# EAGLE design inker_super_board_ver0 (EAGLE 9.5.2)
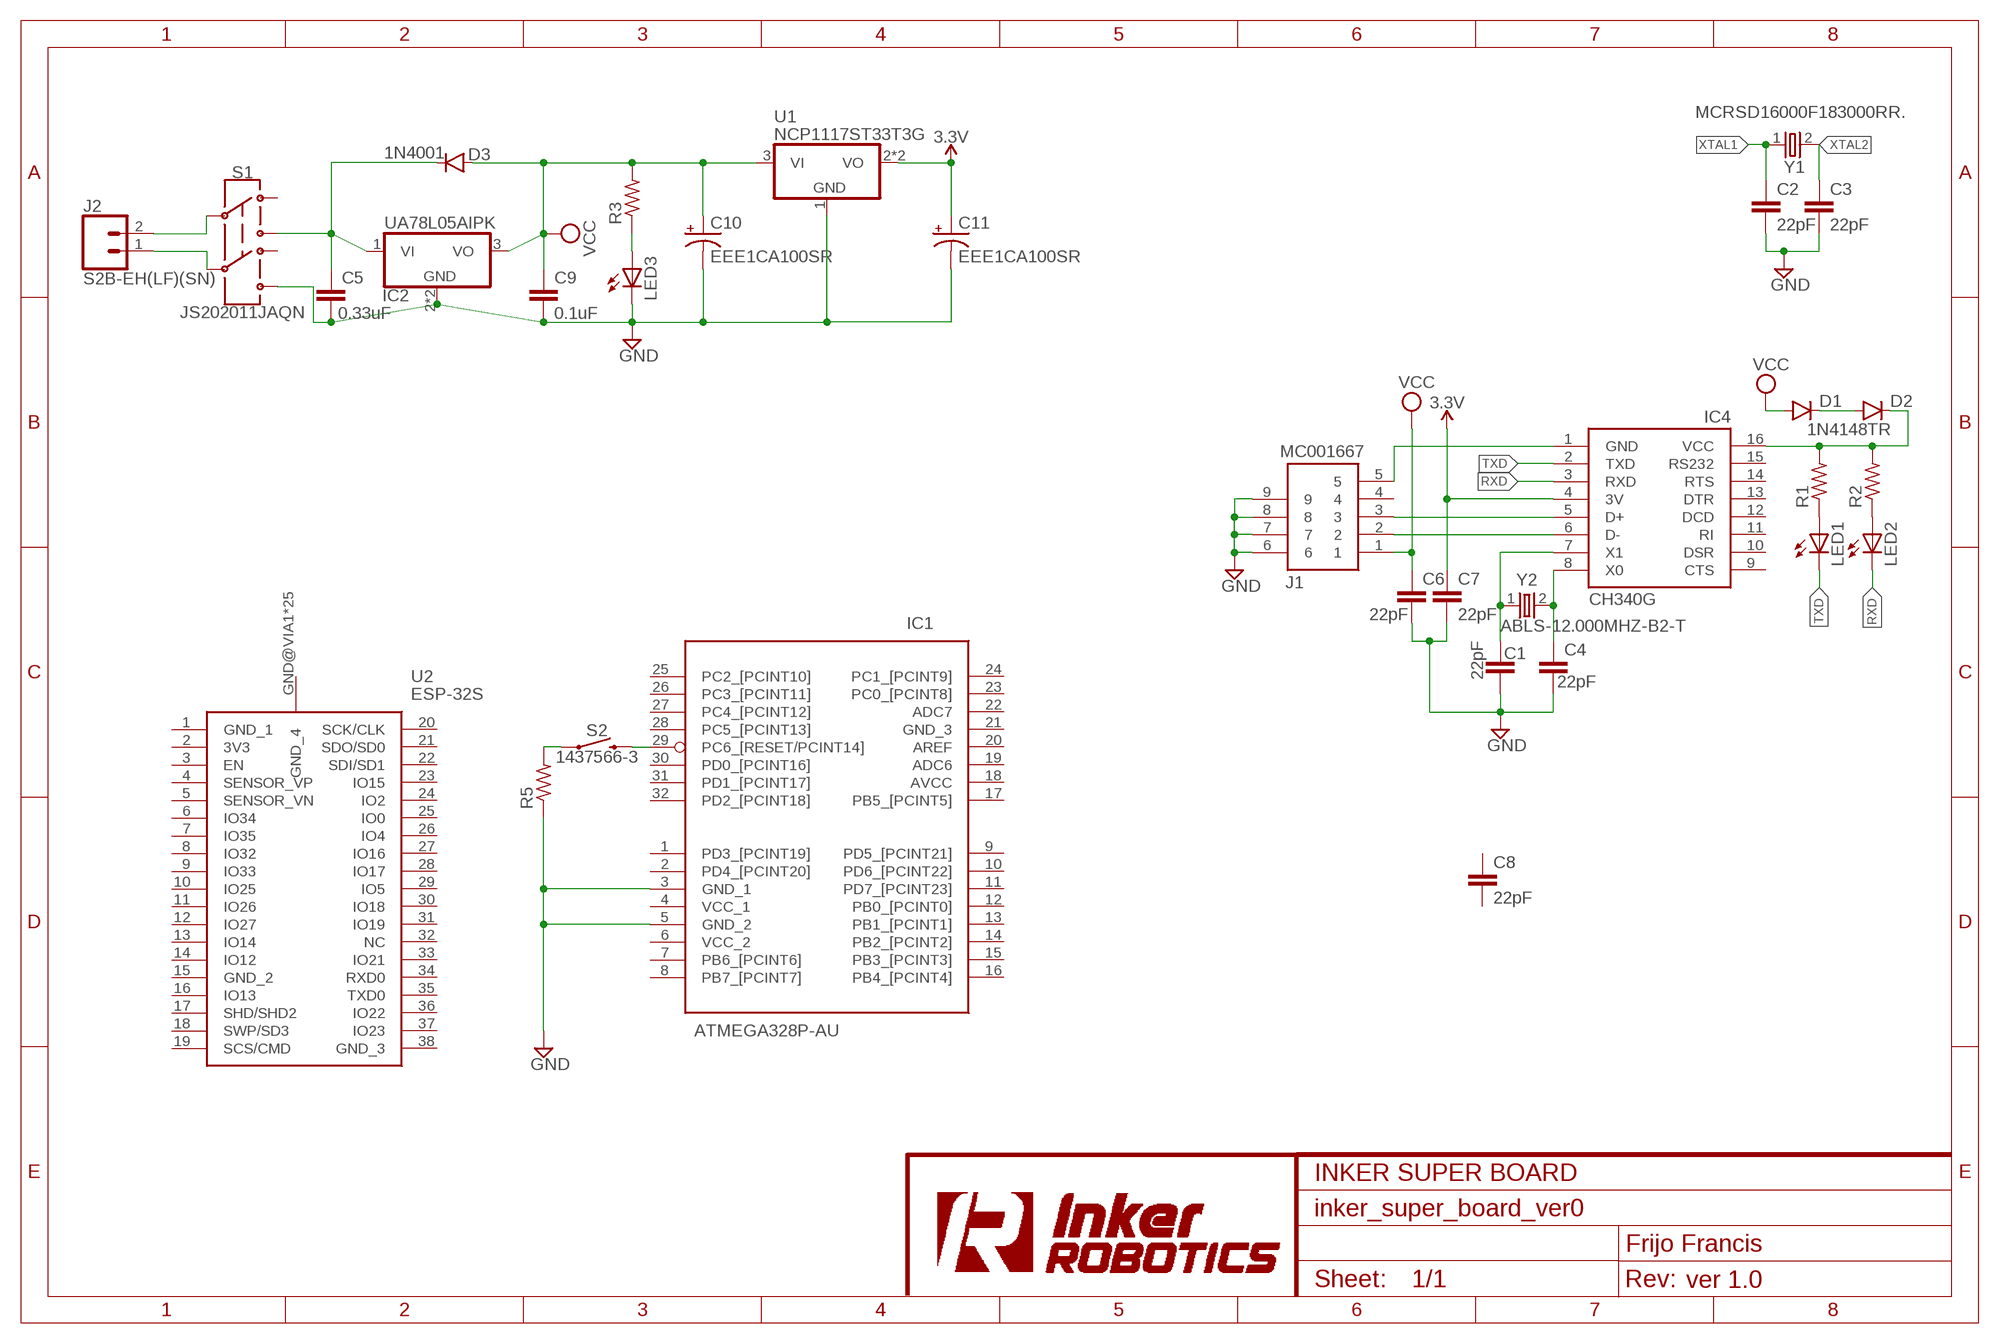
[diagram p0: schematic, sheet 1]
FRAME1 (FRAME-A4L): CNAME: INKER SUPER BOARD; CREVISION: ver 1.0; DESIGNER: Frijo Francis

## Parts
C1  22pF  22PF-0603-50V-5%  [0603]
C2  22pF  22PF-0603-50V-5%  [0603]
C3  22pF  22PF-0603-50V-5%  [0603]
C4  22pF  22PF-0603-50V-5%  [0603]
C5  0.33uF  1.0UF-0805-25V-10%  [0805]
C6  22pF  22PF-0603-50V-5%  [0603]
C7  22pF  22PF-0603-50V-5%  [0603]
C8  22pF  22PF-0603-50V-5%  [0603]
C9  0.1uF  1.0UF-0805-25V-10%  [0805]
C10  EEE1CA100SR  [EEE1CA100SR]
C11  EEE1CA100SR  [EEE1CA100SR]
D1  1N4148TR  [DIOAD990W55L340D162]
D2  1N4148TR  [DIOAD990W55L340D162]
D3  1N4001  [DIOAD1405W86L465D235]
IC1  ATMEGA328P-AU  [QFP80P900X900X120-32N]
IC2  UA78L05AIPK  [PK(R-PSSO-F3)]
IC4  CH340G  [SO16]
J1  MC001667  [MC001667]
J2  S2B-EH(LF)(SN)  [SHDR2W64P0X250_1X2_750X820X420]
LED1  LEDCHIP-LED0805  [CHIP-LED0805]
LED2  LEDCHIP-LED0805  [CHIP-LED0805]
LED3  LEDCHIP-LED0805  [CHIP-LED0805]
R1  R-US_R0805  [R0805]
R2  R-US_R0805  [R0805]
R3  R-US_R0805  [R0805]
R5  R-US_R0805  [R0805]
S1  JS202011JAQN  [JS202011JAQN]
S2  1437566-3  [14375663]
U1  NCP1117ST33T3G  [SOT230P700X180-4N]
U2  ESP-32S  [ESP-32S]
Y1  MCRSD16000F183000RR.  [MCRSD16000F183000RR]
Y2  ABLS-12.000MHZ-B2-T  [ABLS-12.000MHZ-B2]

## Nets
3.3V: C7.1 C11.1(+) IC4.4(3V) U1.2(VO) U1.4(VO)
GND: C1.2 C2.2 C3.2 C4.2 C5.2 C6.2 C7.2 C9.2 C10.2(-) C11.2(-) IC1.3(GND_1) IC1.5(GND_2) IC2.2(GND) IC2.4(GND) J1.6 J1.7 J1.8 J1.9 LED3.C R5.1 S1.6 U1.1(GND)
N$1: LED1.A R1.1
N$2: LED2.A R2.1
N$3: LED3.A R3.1
N$4: IC1.29(PC6_[RESET/PCINT14]) S2.2
N$5: R5.2 S2.1
N$6: C1.1 IC4.7(X1) Y2.1
N$7: C4.1 IC4.8(X0) Y2.2
N$8: D2.1(C) IC4.16(VCC) R1.2 R2.2
N$9: D1.1(C) D2.2(A)
N$10: IC4.6(D-) J1.2
N$11: IC4.5(D+) J1.3
N$12: J2.2 S1.2
N$13: J2.1 S1.5
N$16: IC4.1(GND) J1.5
RXD: IC4.3(RXD) LED2.C
TXD: IC4.2(TXD) LED1.C
VCC: C6.1 C9.1 C10.1(+) D1.2(A) D3.2(A) IC2.3(VO) J1.1 R3.2 U1.3(VI)
VIN: C5.1 D3.1(C) IC2.1(VI) S1.3
XTAL1: C2.1 Y1.1
XTAL2: C3.1 Y1.2
Unconnected: C8.1 C8.2 IC1.1(PD3_[PCINT19]) IC1.2(PD4_[PCINT20]) IC1.7(PB6_[PCINT6]) IC1.8(PB7_[PCINT7]) IC1.9(PD5_[PCINT21]) IC1.10(PD6_[PCINT22]) IC1.11(PD7_[PCINT23]) IC1.12(PB0_[PCINT0]) IC1.13(PB1_[PCINT1]) IC1.14(PB2_[PCINT2]) IC1.15(PB3_[PCINT3]) IC1.16(PB4_[PCINT4]) IC1.17(PB5_[PCINT5]) IC1.19(ADC6) IC1.20(AREF) IC1.22(ADC7) IC1.23(PC0_[PCINT8]) IC1.24(PC1_[PCINT9]) IC1.25(PC2_[PCINT10]) IC1.26(PC3_[PCINT11]) IC1.27(PC4_[PCINT12]) IC1.28(PC5_[PCINT13]) IC1.30(PD0_[PCINT16]) IC1.31(PD1_[PCINT17]) IC1.32(PD2_[PCINT18]) IC4.9(CTS) IC4.10(DSR) IC4.11(RI) IC4.12(DCD) IC4.13(DTR) IC4.14(RTS) IC4.15(RS232) J1.4 S1.1 S1.4 U2.1(GND_1) U2.2(3V3) U2.3(EN) U2.4(SENSOR_VP) U2.5(SENSOR_VN) U2.6(IO34) U2.7(IO35) U2.8(IO32) U2.9(IO33) U2.10(IO25) U2.11(IO26) U2.12(IO27) U2.13(IO14) U2.14(IO12) U2.15(GND_2) U2.16(IO13) U2.17(SHD/SHD2) U2.18(SWP/SD3) U2.19(SCS/CMD) U2.20(SCK/CLK) U2.21(SDO/SD0) U2.22(SDI/SD1) U2.23(IO15) U2.24(IO2) U2.25(IO0) U2.26(IO4) U2.27(IO16) U2.28(IO17) U2.29(IO5) U2.30(IO18) U2.31(IO19) U2.32(NC) U2.33(IO21) U2.34(RXD0) U2.35(TXD0) U2.36(IO22) U2.37(IO23) U2.38(GND_3) U2.GND@VIA1(GND_4) U2.GND@VIA2(GND_4) U2.GND@VIA3(GND_4) U2.GND@VIA4(GND_4) U2.GND@VIA5(GND_4) U2.GND@VIA6(GND_4) U2.GND@VIA7(GND_4) U2.GND@VIA8(GND_4) U2.GND@VIA9(GND_4) U2.GND@VIA10(GND_4) U2.GND@VIA11(GND_4) U2.GND@VIA12(GND_4) U2.GND@VIA13(GND_4) U2.GND@VIA14(GND_4) U2.GND@VIA15(GND_4) U2.GND@VIA16(GND_4) U2.GND@VIA17(GND_4) U2.GND@VIA18(GND_4) U2.GND@VIA19(GND_4) U2.GND@VIA20(GND_4) U2.GND@VIA21(GND_4) U2.GND@VIA22(GND_4) U2.GND@VIA23(GND_4) U2.GND@VIA24(GND_4) U2.GND@VIA25(GND_4)

## Power pins joined to a net without a drawn wire
AVCC: IC1.18(AVCC)
GND_3: IC1.21(GND_3)
VCC_1: IC1.4(VCC_1)
VCC_2: IC1.6(VCC_2)

## Library data of the parts
C1-C4 C6-C8 = SparkFun-Capacitors:22PF: 22pF ceramic capacitors A capacitor is a passive two-terminal electrical component used to store electrical energy temporarily in an electric field.; PROD_ID: CAP-07876
C5 C9 = SparkFun-Capacitors:1.0UF: 1µF ceramic capacitors A capacitor is a passive two-terminal electrical component used to store electrical energy temporarily in an electric field.; PROD_ID: CAP-08064; VALUE: 1.0uF
C10 C11 = inker_blue_board_parts:EEE1CA100SR: Specifications SMD Aluminium Electrolytic Capacitor, Radial Can - SMD, 10 µF, 16 V, S Series, 2000 hours @ 85°C 4mmx5.4mm Data Sheet <http://www.farnell.com/datasheets/2820389.pdf?_ga=2.97766294.826706780.1579496581-49794231.1579175850&_gac=1.88196841.1579699319.CjwKCAiAgqDxBRBTEiwA59eEN7pioChiorycKBgKjnCHc4IfiDMsctUZX92ybQI3HFoqLGgSVzjkWRoClNIQAvD_BwE> Buy From Element14.com <https://in.element14.com/panasonic/eee1ca100sr/cap-10-f-16v-smd-reel/dp/2753038>
D1 D2 = inker_blue_board_parts:1N4148TR: DIODE, SMALL SIGNAL, 100V, 450MA, DO-35 PKG Source: Datasheet <https://www.vishay.com/docs/81857/1n4148.pdf>; DESCRIPTION: DIODE, SMALL SIGNAL, 100V, 450MA, DO-35 PKG; HEIGHT: mm; MANUFACTURER_NAME: Vishay; MANUFACTURER_PART_NUMBER: 1N4148TR; MOUSER_PART_NUMBER: 78-1N4148; MOUSER_PRICE-STOCK: https://www.mouser.com/Search/Refine.aspx?Keyword=78-1N4148; RS_PART_NUMBER: 1808536; RS_PRICE-STOCK: http://uk.rs-online.com/web/p/products/1808536
D3 = inker_blue_board_parts:1N4001: Vishay 1N4001 Diode, 50V 1A, 2-Pin DO-204AL Source: Datasheet <https://www.vishay.com/docs/88503/1n4001.pdf>; DESCRIPTION: Vishay 1N4001 Diode, 50V 1A, 2-Pin DO-204AL; HEIGHT: mm; MANUFACTURER_NAME: Vishay; MANUFACTURER_PART_NUMBER: 1N4001; RS_PART_NUMBER: 0261148A; RS_PRICE-STOCK: http://uk.rs-online.com/web/p/products/0261148A
IC1 = inker_blue_board_parts:ATMEGA328P-AU: MICROCHIP - ATMEGA328P-AU. - MICROCONTROLLER MCU, 8 BIT, ATMEGA, 20MHZ, TQFP-32 Source: Datasheet <https://componentsearchengine.com/Datasheets/2/ATMEGA328P-AU.pdf>; DESCRIPTION: MICROCHIP - ATMEGA328P-AU. - MICROCONTROLLER MCU, 8 BIT, ATMEGA, 20MHZ, TQFP-32; HEIGHT: 1.2mm; MANUFACTURER_NAME: Microchip; MANUFACTURER_PART_NUMBER: ATMEGA328P-AU; MOUSER_PART_NUMBER: 556-ATMEGA328P-AU; MOUSER_PRICE-STOCK: https://www.mouser.com/Search/Refine.aspx?Keyword=556-ATMEGA328P-AU; RS_PART_NUMBER: 1310271P; RS_PRICE-STOCK: http://uk.rs-online.com/web/p/products/1310271P
IC2 = inker_blue_board_parts:UA78L05AIPK: 100-mA, 30-V VIN, Positive-Voltage Linear Regulators Source: Datasheet <http://www.ti.com/lit/ds/symlink/ua78l.pdf>; DESCRIPTION: 100-mA, 30-V VIN, Positive-Voltage Linear Regulators; HEIGHT: mm; MANUFACTURER_NAME: Texas Instruments; MANUFACTURER_PART_NUMBER: UA78L05AIPK; MOUSER_PART_NUMBER: 595-UA78L05AIPK; MOUSER_PRICE-STOCK: https://www.mouser.com/Search/Refine.aspx?Keyword=595-UA78L05AIPK; RS_PART_NUMBER: 6614598P; RS_PRICE-STOCK: http://uk.rs-online.com/web/p/products/6614598P
IC4 = inker_blue_board_parts:CH340G: CH340G SOIC16 USB to Serial TTL-RS232 converter IC Full speed USB device interface, conforms to USB Specification Version 2.0, only needs crystal and capacitance external. Emulate standard serial interface, used to upgrade the former peripheral device, or add excess serial interface through USB. Totally compatible with the serial application program in a computer endpoint Windows operation system. Hardware full duplex serial interface, set transceiver buffer, supports communication baud rate varies from 50bps to 2Mbps. Supports common MODEM liaison signal RTS, DTR, DCD, RI, DSR and CTS. Through adding level converter equipment to supply RS232, RS485, RS422 and another interface. Supports IrDA criterion SIR infrared communication, supports baud rate varies from 2400bps to 115200bps.
J1 = inker_blue_board_parts:MC001667: MULTICOMP - MC001667 - MICRO USB, TYPE B, RCPT, SMT Source: Datasheet <https://componentsearchengine.com/Datasheets/2/MC001667.pdf>; DESCRIPTION: MULTICOMP - MC001667 - MICRO USB, TYPE B, RCPT, SMT; HEIGHT: 2mm; MANUFACTURER_NAME: MULTICOMP; MANUFACTURER_PART_NUMBER: MC001667
J2 = inker_blue_board_parts:S2B-EH(LF)(SN): JST (JAPAN SOLDERLESS TERMINALS) - S2B-EH(LF)(SN) - CONNECTOR, HEADER, 2POS, 1ROW, 2.5MM Source: Datasheet <http://www.jst-mfg.com/product/pdf/eng/eEH.pdf>; DESCRIPTION: JST (JAPAN SOLDERLESS TERMINALS) - S2B-EH(LF)(SN) - CONNECTOR, HEADER, 2POS, 1ROW, 2.5MM; HEIGHT: 4.2mm; MANUFACTURER_NAME: JST (JAPAN SOLDERLESS TERMINALS); MANUFACTURER_PART_NUMBER: S2B-EH(LF)(SN)
LED1-LED3 = adafruit:LED: LED OSRAM: - CHIPLED LG R971, LG N971, LY N971, LG Q971, LY Q971, LO R971, LY R971 LH N974, LH R974 LS Q976, LO Q976, LY Q976 LO Q996 - Hyper CHIPLED LW Q18S LB Q993, LB Q99A, LB R99A - SideLED LS A670, LO A670, LY A670, LG A670, LP A670 LB A673, LV A673, LT A673, LW A673 LH A674 LY A675 LS A676, LA A676, LO A676, LY A676, LW A676 LS A679, LY A679, LG A679 - Hyper Micro SIDELED® LS Y876, LA Y876, LO Y876, LY Y876 LT Y87S - SmartLED LW L88C, LW L88S LB L89C, LB L89S, LG L890 LS L89K, LO L89K, LY L89K LS L896, LA L896, LO L896, LY L896 - TOPLED LS T670, LO T670, LY T670, LG T670, LP T670 LSG T670, LSP T670, LSY T670, LOP T670, LYG T670 LG T671, LOG T671, LSG T671 LB T673, LV T673, LT T673, LW T673 LH T674 LS T676, LA T676, LO T676, LY T676, LB T676, LH T676, LSB T676, LW T676 LB T67C, LV T67C, LT T67C, LS T67K, LO T67K, LY T67K, LW E67C LS E67B, LA E67B, LO E67B, LY E67B, LB E67C, LV E67C, LT E67C LW T67C LS T679, LY T679, LG T679 LS T770, LO T770, LY T770, LG T770, LP T770 LB T773, LV T773, LT T773, LW T773 LH T774 LS E675, LA E675, LY E675, LS T675 LS T776, LA T776, LO T776, LY T776, LB T776 LHGB T686 LT T68C, LB T68C - Hyper Mini TOPLED® LB M676 - Mini TOPLED Santana® LG M470 LS M47K, LO M47K, LY M47K Source: http://www.osram.convergy.de/
R1-R3 R5 = adafruit:R-US_: RESISTOR, American symbol
S1 = inker_blue_board_parts:JS202011JAQN: JS Series Sub-Miniature Slide Switch Source: Datasheet <https://www.ckswitches.com/media/1422/js.pdf>; DESCRIPTION: JS Series Sub-Miniature Slide Switch; HEIGHT: 3mm; MANUFACTURER_NAME: C & K COMPONENTS; MANUFACTURER_PART_NUMBER: JS202011JAQN; MOUSER_PART_NUMBER: 611-JS202011JAQN; MOUSER_PRICE-STOCK: https://www.mouser.com/Search/Refine.aspx?Keyword=611-JS202011JAQN
S2 = inker_blue_board_parts:1437566-3: TE CONNECTIVITY / ALCOSWITCH - 1437566-3 - PUSHBUTTON SWITCH, SPST, 0.05A, 24V Source: Datasheet <https://www.te.com/commerce/DocumentDelivery/DDEController?Action=showdoc&DocId=Customer Drawing1437566-3C2pdfEnglishENG_CD_1437566-3_C2_1437566_3_1_c.dwg.pdf1437566-3>; ALLIED_NUMBER: 71210411; ALLIED_PRICE-STOCK: https://www.alliedelec.com/te-connectivity-1437566-3/71210411/; DESCRIPTION: TE CONNECTIVITY / ALCOSWITCH - 1437566-3 - PUSHBUTTON SWITCH, SPST, 0.05A, 24V; HEIGHT: 4.57mm; MANUFACTURER_NAME: TE Connectivity; MANUFACTURER_PART_NUMBER: 1437566-3; MOUSER_PART_NUMBER: N/A; MOUSER_PRICE-STOCK: https://www.mouser.com/Search/Refine.aspx?Keyword=N%2FA
U1 = inker_blue_board_parts:NCP1117ST33T3G; ALLIED_NUMBER: 70340559; ALLIED_PRICE-STOCK: http://www.alliedelec.com/on-semiconductor-ncp1117st33t3g/70340559/; COPYRIGHT: Copyright (C) 2016 Accelerated Designs. All rights reserved; DESCRIPTION: ON SEMICONDUCTOR - NCP1117ST33T3G - IC, LINEAR VOLTAGE REGULATOR; HEIGHT: 1.8mm; MANUFACTURER_NAME: ON Semiconductor; MANUFACTURER_PART_NUMBER: NCP1117ST33T3G; MOUSER_PART_NUMBER: 863-NCP1117ST33T3G; MOUSER_PRICE-STOCK: https://www.mouser.com/Search/Refine.aspx?Keyword=863-NCP1117ST33T3G; RS_PART_NUMBER: 7857207P; RS_PRICE-STOCK: http://uk.rs-online.com/web/p/products/7857207P
U2 = inker_super_board_parts:ESP-32S: WiFi-BT-BLE MCU module Description The ESP32-S is an Original ESP32 series module from Ai-Thinker. This wireless module based on ESP32, supports WiFi and Bluetooth 4.2, with built-in 32Mbit Flash, in the SMD38 package. There're also onboard PCB antenna and metal shield. In short, it's a small form factor and fairly high cost-effective wireless module. With the pre-flashed AT firmware, you can control the module through UART AT commands easily. The module integrates MCU inside, supports other developments like Lua/Micropython/Arduino to achieve flexible and fast prototyping, make it easy to integrate the module into IoT applications. Ai-Thinker's ESP32-S WiFi+BT SoC Module has a highly competitive package size and ultra-low power technology. Esp32-S can be widely used in various networking, for home automation, industrial wireless control, baby monitors, wearable electronics products, wireless position sensing devices, wireless positioning system signals, and other networking applications. Esp32-S is packaged in SMD, through the standard SMT equipment to achieve rapid production of products, to provide customers with high reliability of the connection, especially for Automation, large-scale, low-cost modern production methods, It’s suitable for all kinds of Internet of things hardware terminal occasions. Applications: The ESP32-S suit for many IoT applications such as: Smart home Intelligent building Industrial automation Wearable devices IP camera Intelligent agriculture Source: Datasheet <https://www.es.co.th/Schemetic/PDF/ESP32.PDF>; DESCRIPTION: WiFi-BT-BLE MCU module; HEIGHT: mm; MANUFACTURER_NAME: Ai-Thinker; MANUFACTURER_PART_NUMBER: ESP-32s
Y1 = inker_blue_board_parts:MCRSD16000F183000RR.: Crystal Resonator Source: Datasheet <http://www.farnell.com/datasheets/1801275.pdf?_ga=2.161758137.465763355.1570477591-1898509310.1560488301>; DESCRIPTION: Crystal Resonator; HEIGHT: 4.3mm; MANUFACTURER_NAME: MULTICOMP; MANUFACTURER_PART_NUMBER: MCRSD16000F183000RR.
Y2 = inker_blue_board_parts:ABLS-12.000MHZ-B2-T: HC/49US Crystal 12Mhz Source: Datasheet <https://abracon.com/Resonators/abls.pdf>; DESCRIPTION: HC/49US Crystal 12Mhz; HEIGHT: mm; MANUFACTURER_NAME: ABRACON; MANUFACTURER_PART_NUMBER: ABLS-12.000MHZ-B2-T; MOUSER_PART_NUMBER: 815-ABLS-12-B2; MOUSER_PRICE-STOCK: https://www.mouser.com/Search/Refine.aspx?Keyword=815-ABLS-12-B2; RS_PART_NUMBER: 1710488P; RS_PRICE-STOCK: http://uk.rs-online.com/web/p/products/1710488P

## Board
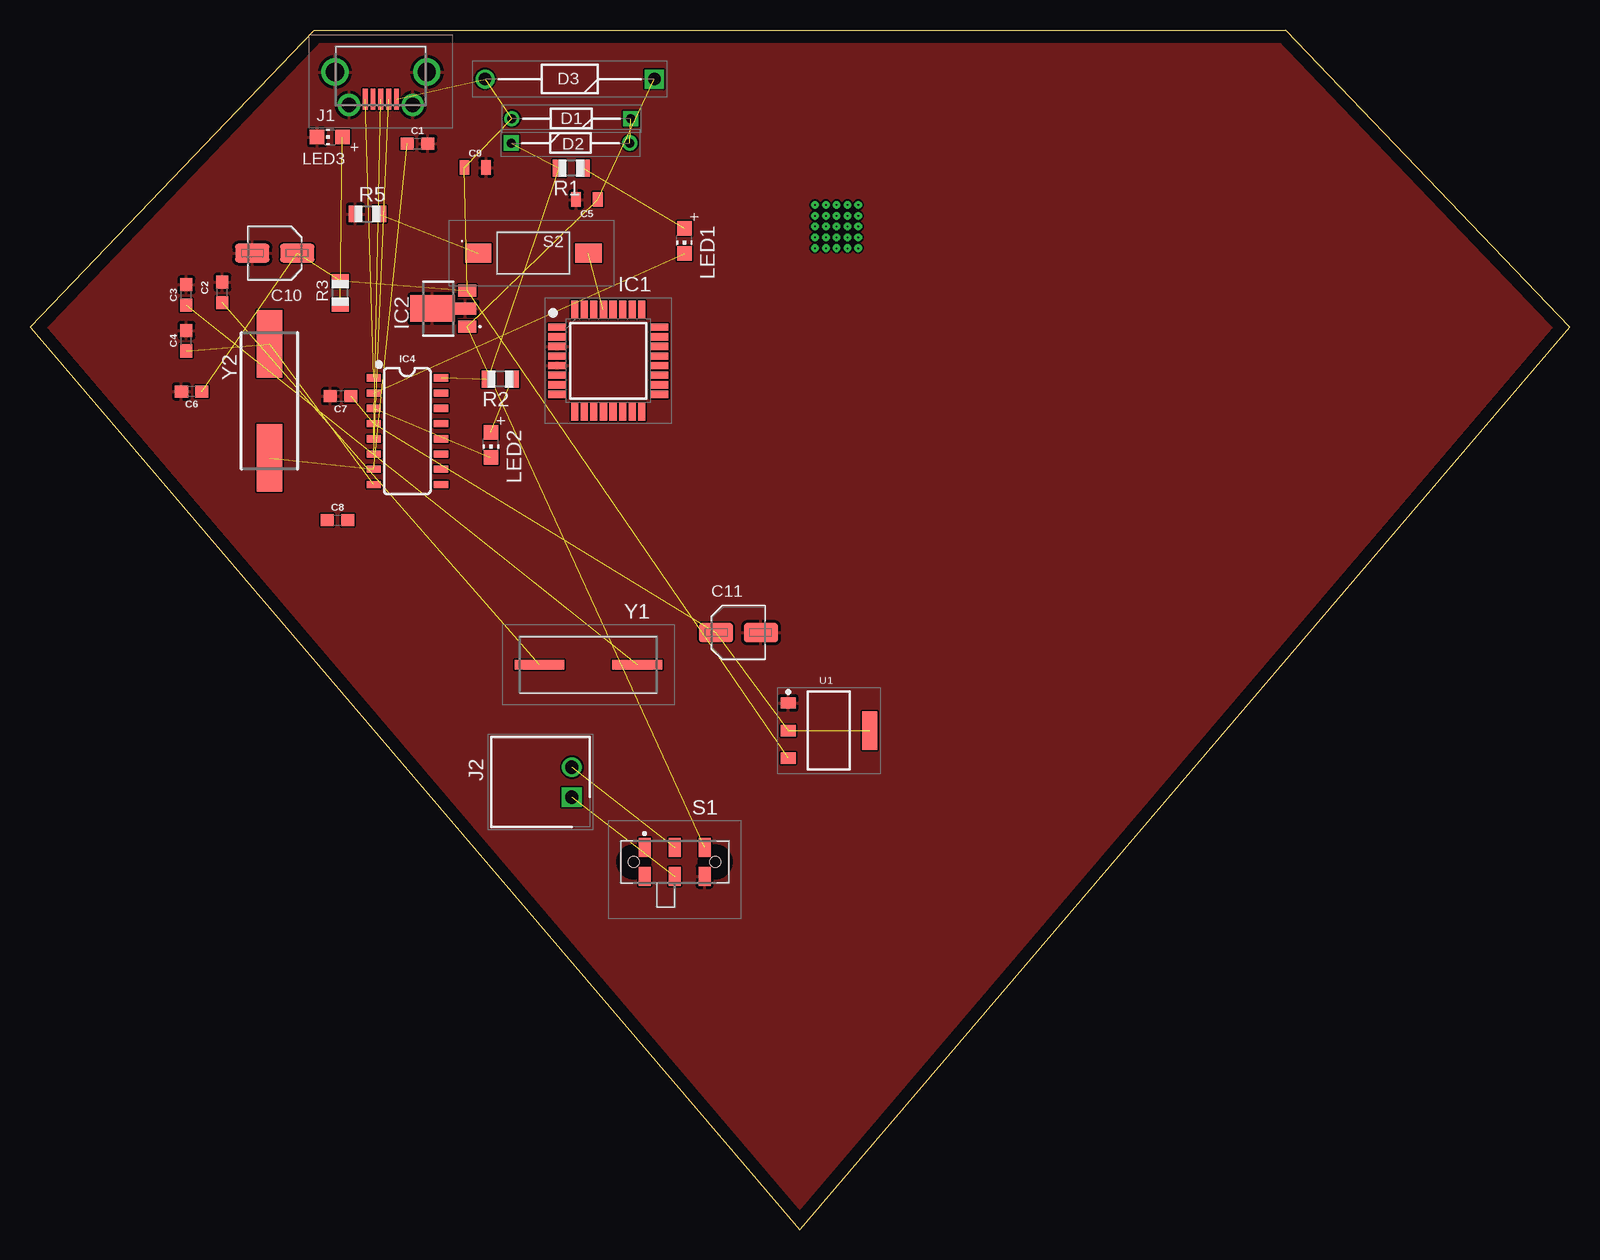
[diagram p1: board, top side]
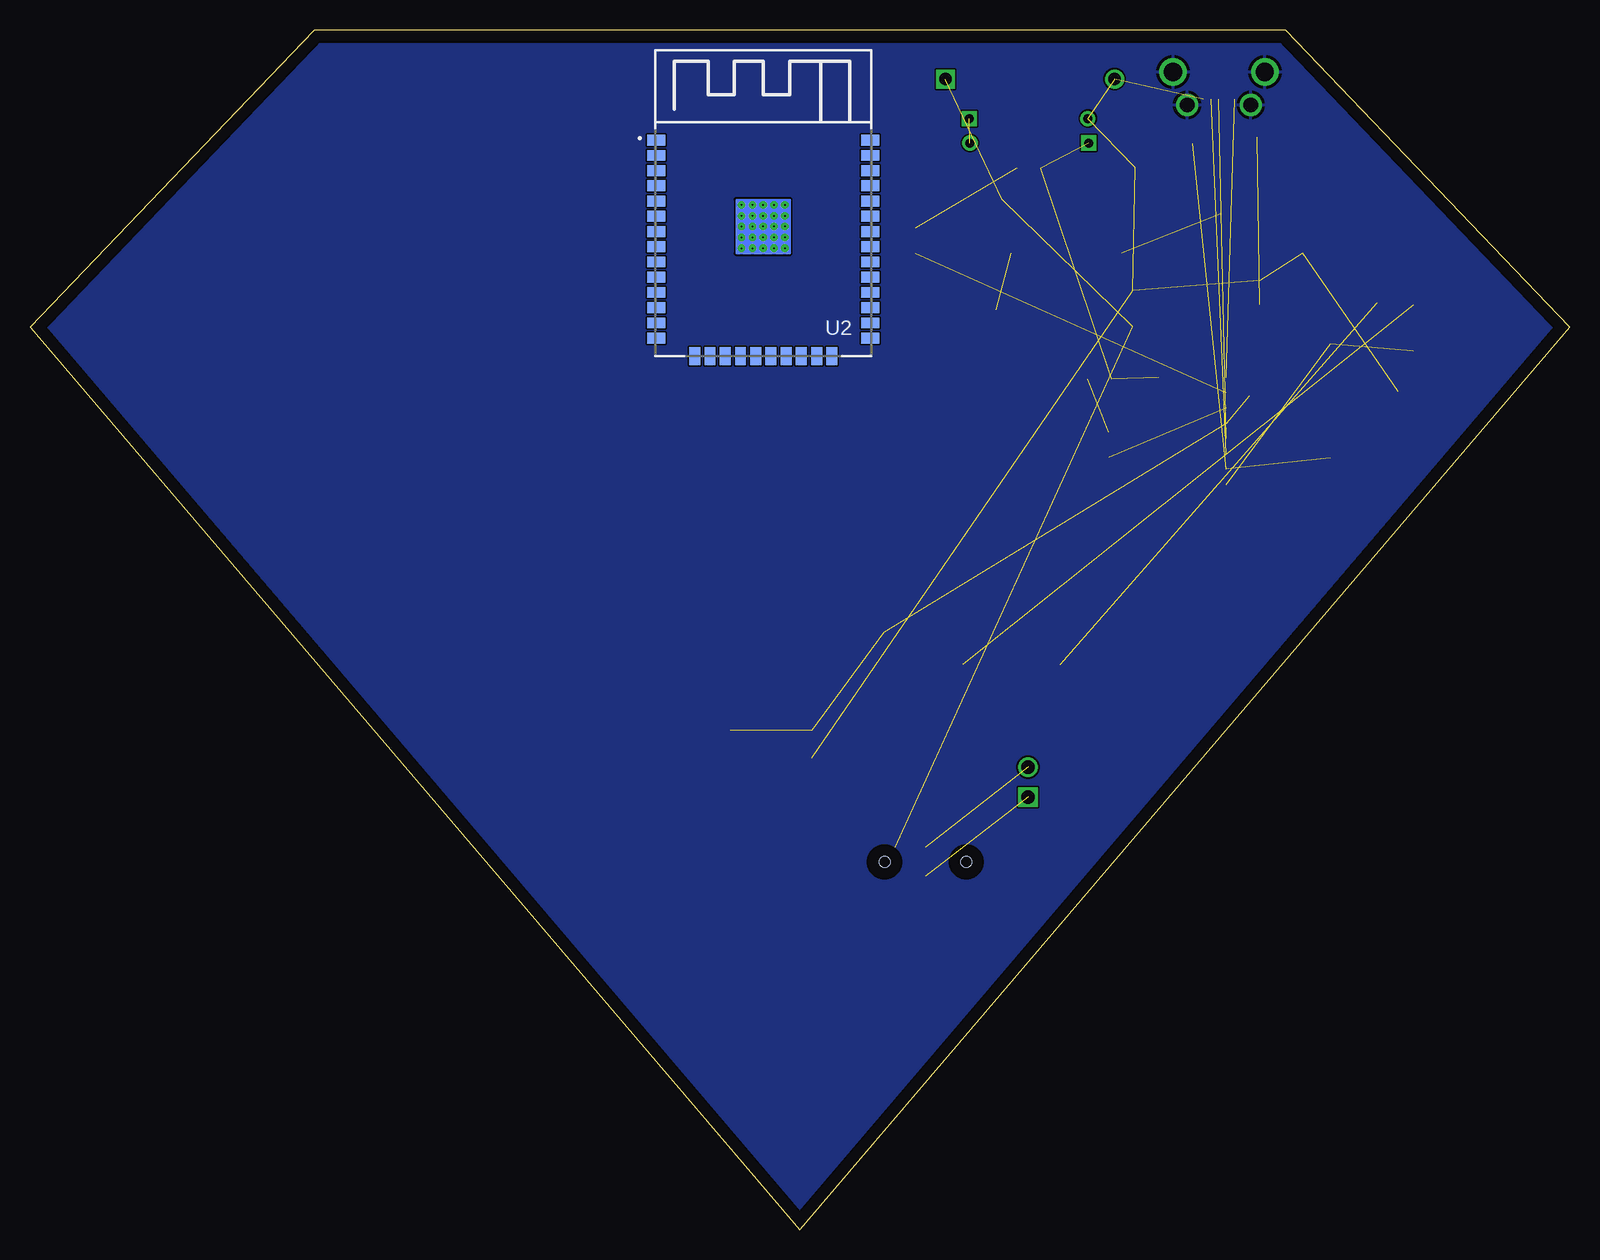
[diagram p2: board, bottom side, seen from below]

Size 128.32 x 100 mm. Coordinates in mm from the lower left corner, seen from the top.
Outline: 128.32,75.21 104.64,100 23.68,100 0,75.21 64.16,0 128.32,75.21
Copper layers (1*16): Top 0.035mm / dielectric 1.5mm / Bottom 0.035mm
Design rules "default *": minimum track width 0.3mm, minimum drill 0.35mm, track to track 6mil, track to pad 6mil, pad to pad 6mil, via to via 6mil, smd to smd 6mil, copper to edge 40mil, drill to drill 6mil, minimum pad ring 10mil, minimum via ring 8mil, stop-mask expansion 4mil, vias tented up to drill 0mil, thermal gap 10mil

### Footprints (pad centres in the part's own frame; a part is rotated, then mirrored left to right if it is on the bottom)
0603 = smd 1.1 x 1: 1 -0.85,0; 2 0.85,0
0805 = smd 0.8 x 1.2: 1 -0.9,0; 2 0.9,0
EEE1CA100SR = smd 2.86 x 1.58: 1 -1.875,0; 2 1.875,0
DIOAD990W55L340D162 = drill 0.75 pad 1.15 square: 1 0,0 | drill 0.75 pad 1.15: 2 9.9,0
DIOAD1405W86L465D235 = drill 1.05 pad 1.575 square: 1 0,0 | drill 1.05 pad 1.575: 2 14.1,0
QFP80P900X900X120-32N = smd 1.5 x 0.6: 1 -4.25,2.8; 2 -4.25,2; 3 -4.25,1.2; 4 -4.25,0.4; 5 -4.25,-0.4; 6 -4.25,-1.2; 7 -4.25,-2; 8 -4.25,-2.8; 17 4.25,-2.8; 18 4.25,-2; 19 4.25,-1.2; 20 4.25,-0.4; 21 4.25,0.4; 22 4.25,1.2; 23 4.25,2; 24 4.25,2.8 | smd 0.6 x 1.5: 9 -2.8,-4.25; 10 -2,-4.25; 11 -1.2,-4.25; 12 -0.4,-4.25; 13 0.4,-4.25; 14 1.2,-4.25; 15 2,-4.25; 16 2.8,-4.25; 25 2.8,4.25; 26 2,4.25; 27 1.2,4.25; 28 0.4,4.25; 29 -0.4,4.25; 30 -1.2,4.25; 31 -2,4.25; 32 -2.8,4.25
PK(R-PSSO-F3) = smd 1 x 1.5: 1 -1.5,-3.65; 3 1.5,-3.65 | smd 1 x 1.8: 2 0,-3.5 | smd 2.2 x 3.7: 4 0,-0.75
SO16 = smd 0.6 x 1.2: 1 -4.445,-2.8; 2 -3.175,-2.8; 3 -1.905,-2.8; 4 -0.635,-2.8; 5 0.635,-2.8; 6 1.905,-2.8; 7 3.175,-2.8; 8 4.445,-2.8; 9 4.445,2.8; 10 3.175,2.8; 11 1.905,2.8; 12 0.635,2.8; 13 -0.635,2.8; 14 -1.905,2.8; 15 -3.175,2.8; 16 -4.445,2.8
MC001667 = smd 0.4 x 1.75: 1 -1.3,1.487; 2 -0.65,1.487; 3 0,1.487; 4 0.65,1.487; 5 1.3,1.487 | drill 1.235 pad 1.852: 6 -2.65,1.962; 7 2.65,1.962 | drill 1.521 pad 2.281: 8 -3.825,-0.788; 9 3.825,-0.788
SHDR2W64P0X250_1X2_750X820X420 = drill 1.1 pad 1.65 square: 1 0,0 | drill 1.1 pad 1.65: 2 2.5,0
CHIP-LED0805 = smd 1.2 x 1.2: A 0,-1.05; C 0,1.05
R0805 = smd 1.1 x 1.4: 1 -1,0; 2 1,0
JS202011JAQN = smd 1 x 1.6: 1 -2.5,2.95; 2 0,2.95; 3 2.5,2.95; 4 -2.5,0.55; 5 0,0.55; 6 2.5,0.55 | hole 0.9: -3.4,1.75; 3.4,1.75
14375663 = smd 2.18 x 1.6: 1 -4.59,0; 2 4.59,0
SOT230P700X180-4N = smd 1.25 x 0.95: 1 -3.4,2.3; 2 -3.4,0; 3 -3.4,-2.3 | smd 1.25 x 3.2: 4 3.4,0
ESP-32S = smd 1.5 x 0.9: 1 -8.9,18.01; 2 -8.9,16.74; 3 -8.9,15.47; 4 -8.9,14.2; 5 -8.9,12.93; 6 -8.9,11.66; 7 -8.9,10.39; 8 -8.9,9.12; 9 -8.9,7.85; 10 -8.9,6.58; 11 -8.9,5.31; 12 -8.9,4.04; 13 -8.9,2.77; 14 -8.9,1.5; 25 8.9,1.5; 26 8.9,2.77; 27 8.9,4.04; 28 8.9,5.31; 29 8.9,6.58; 30 8.9,7.85; 31 8.9,9.12; 32 8.9,10.39; 33 8.9,11.66; 34 8.9,12.93; 35 8.9,14.2; 36 8.9,15.47; 37 8.9,16.74; 38 8.9,18.01 | smd 0.9 x 1.5: 15 -5.71,0; 16 -4.44,0; 17 -3.17,0; 18 -1.9,0; 19 -0.63,0; 20 0.64,0; 21 1.91,0; 22 3.18,0; 23 4.45,0; 24 5.72,0 | drill 0.127 pad 0.254: GND@VIA1 -1.8,12.6; GND@VIA2 -0.9,12.6; GND@VIA3 0,12.6; GND@VIA4 0.9,12.6; GND@VIA5 1.8,12.6; GND@VIA6 -1.8,11.7; GND@VIA7 -0.9,11.7; GND@VIA8 0,11.7; GND@VIA9 0.9,11.7; GND@VIA10 1.8,11.7; GND@VIA11 -1.8,10.8; GND@VIA12 -0.9,10.8; GND@VIA13 0,10.8; GND@VIA14 0.9,10.8; GND@VIA15 1.8,10.8; GND@VIA16 -1.8,9.9; GND@VIA17 -0.9,9.9; GND@VIA18 0,9.9; GND@VIA19 0.9,9.9; GND@VIA20 1.8,9.9; GND@VIA21 -1.8,9; GND@VIA22 -0.9,9; GND@VIA23 0,9; GND@VIA24 0.9,9; GND@VIA25 1.8,9
MCRSD16000F183000RR = smd 4.15 x 0.8: 1 -4.075,0; 2 4.075,0
ABLS-12.000MHZ-B2 = smd 5.6 x 2.1: 1 -4.75,0; 2 4.75,0

### Placement (x,y rotation side)
C1  32.29,90.53 0 top
C2  16.03,78.12 90 top
C3  13.03,77.91 90 top
C4  13.03,74.1 90 top
C5  46.41,85.87 180 top
C6  13.47,69.87 180 top
C7  25.88,69.47 180 top
C8  25.63,59.13 0 top
C9  37.1,88.53 0 top
C10  20.4,81.4 180 top
C11  59.04,49.76 0 top
D1  50.06,92.62 180 top
D2  40.09,90.58 0 top
D3  52.03,95.91 180 top
IC1  48.19,72.42 0 top
IC2  32.79,76.78 90 top
IC4  31.45,66.56 270 top
J1  29.24,95.71 180 top
J2  45.15,36.05 90 top
LED1  54.53,82.42 180 top
LED2  38.41,65.42 180 top
LED3  24.98,91.07 90 top
R1  45.11,88.49 180 top
R2  39.19,70.89 180 top
R3  25.85,78.09 90 top
R5  28.12,84.66 0 top
S1  53.71,28.9 0 top
S2  41.95,81.4 0 top
U1  66.58,41.6 0 top
U2  67.22,72.81 0 bottom
Y1  46.53,47.1 0 top
Y2  19.96,69.08 90 top

### Tracks (layer width: path | path; a pad name or v marks a point on that pad's centre or on a via)
3.3V  (4 unrouted)
GND
  pour Bottom: 64.16,0 0,75.21 23.68,100 104.64,100 128.32,75.21
  pour Top: 64.16,0 0,75.21 23.68,100 104.64,100 128.32,75.21
N$1  (1 unrouted)
N$2  (1 unrouted)
N$3  (1 unrouted)
N$4  (1 unrouted)
N$5  (1 unrouted)
N$6  (2 unrouted)
N$7  (2 unrouted)
N$8  (3 unrouted)
N$9  (1 unrouted)
N$10  (1 unrouted)
N$11  (1 unrouted)
N$12  (1 unrouted)
N$13  (1 unrouted)
N$16  (1 unrouted)
RXD  (1 unrouted)
TXD  (1 unrouted)
VCC  (8 unrouted)
VIN  (3 unrouted)
XTAL1  (1 unrouted)
XTAL2  (1 unrouted)